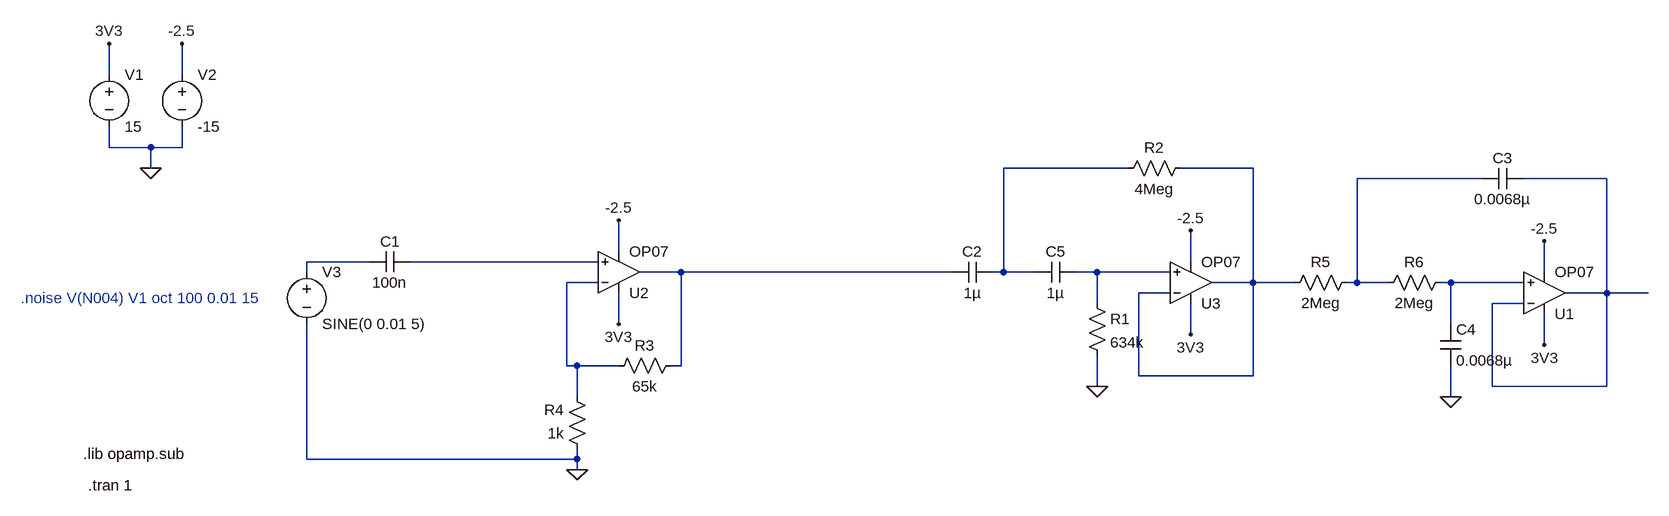
[diagram p0: schematic TI-artikel.asc]
TI-artikel.asc, the LTspice schematic file:
Version 4
SHEET 1 2392 680
WIRE -464 -144 -464 -192
WIRE -352 -144 -352 -192
WIRE -464 -32 -464 -64
WIRE -400 -32 -464 -32
WIRE -352 -32 -352 -64
WIRE -352 -32 -400 -32
WIRE -400 0 -400 -32
WIRE 1104 0 912 0
WIRE 1296 0 1184 0
WIRE 1648 16 1456 16
WIRE 1840 16 1712 16
WIRE 320 128 320 80
WIRE -64 144 -160 144
WIRE 288 144 0 144
WIRE 1200 144 1200 96
WIRE -160 160 -160 144
WIRE 416 160 352 160
WIRE 832 160 416 160
WIRE 912 160 912 0
WIRE 912 160 896 160
WIRE 960 160 912 160
WIRE 1056 160 1024 160
WIRE 1168 160 1056 160
WIRE 1744 160 1744 112
WIRE 288 176 240 176
WIRE 1296 176 1296 0
WIRE 1296 176 1232 176
WIRE 1360 176 1296 176
WIRE 1456 176 1456 16
WIRE 1456 176 1440 176
WIRE 1504 176 1456 176
WIRE 1600 176 1584 176
WIRE 1712 176 1600 176
WIRE 1168 192 1120 192
WIRE 1840 192 1840 16
WIRE 1840 192 1776 192
WIRE 1904 192 1840 192
WIRE 1056 208 1056 160
WIRE 1712 208 1664 208
WIRE 320 240 320 192
WIRE 1600 240 1600 176
WIRE 1200 256 1200 208
WIRE 1744 272 1744 224
WIRE 240 304 240 176
WIRE 256 304 240 304
WIRE 320 304 256 304
WIRE 416 304 416 160
WIRE 416 304 400 304
WIRE 1120 320 1120 192
WIRE 1296 320 1296 176
WIRE 1296 320 1120 320
WIRE 1056 336 1056 288
WIRE 1664 336 1664 208
WIRE 1840 336 1840 192
WIRE 1840 336 1664 336
WIRE 256 352 256 304
WIRE 1600 352 1600 304
WIRE -160 448 -160 240
WIRE 256 448 256 432
WIRE 256 448 -160 448
WIRE 256 464 256 448
FLAG -400 0 0
FLAG -464 -192 3V3
FLAG -352 -192 -2.5
FLAG 320 240 3V3
FLAG 320 80 -2.5
FLAG 256 464 0
FLAG 1600 352 0
FLAG 1744 272 3V3
FLAG 1744 112 -2.5
FLAG 1056 336 0
FLAG 1200 256 3V3
FLAG 1200 96 -2.5
SYMBOL res 416 288 R90
WINDOW 0 0 56 VBottom 2
WINDOW 3 32 56 VTop 2
SYMATTR InstName R3
SYMATTR Value 65k
SYMBOL res 272 448 R180
WINDOW 0 36 76 Left 2
WINDOW 3 36 40 Left 2
SYMATTR InstName R4
SYMATTR Value 1k
SYMBOL OpAmps\\OP07 320 224 M180
SYMATTR InstName U2
SYMBOL voltage -464 -160 R0
WINDOW 123 0 0 Left 0
WINDOW 39 0 0 Left 0
SYMATTR InstName V1
SYMATTR Value 15
SYMBOL voltage -352 -160 R0
WINDOW 123 0 0 Left 0
WINDOW 39 0 0 Left 0
SYMATTR InstName V2
SYMATTR Value -15
SYMBOL voltage -160 144 R0
WINDOW 123 0 0 Left 0
WINDOW 39 0 0 Left 0
SYMATTR InstName V3
SYMATTR Value SINE(0 0.01 5)
SYMBOL res 1456 160 R90
WINDOW 0 0 56 VBottom 2
WINDOW 3 32 56 VTop 2
SYMATTR InstName R5
SYMATTR Value 2Meg
SYMBOL res 1600 160 R90
WINDOW 0 0 56 VBottom 2
WINDOW 3 32 56 VTop 2
SYMATTR InstName R6
SYMATTR Value 2Meg
SYMBOL cap 1712 0 R90
WINDOW 0 0 32 VBottom 2
WINDOW 3 32 32 VTop 2
SYMATTR InstName C3
SYMATTR Value 0.0068µ
SYMATTR SpiceLine V=16 Irms=0 Rser=0.0272 Lser=346p mfg="Würth Elektronik" pn="885012008016 WCAP-CSGP 1206" type="NP0"
SYMBOL cap 1584 240 R0
SYMATTR InstName C4
SYMATTR Value 0.0068µ
SYMATTR SpiceLine V=16 Irms=0 Rser=0.0272 Lser=346p mfg="Würth Elektronik" pn="885012008016 WCAP-CSGP 1206" type="NP0"
SYMBOL OpAmps\\OP07 1744 256 M180
SYMATTR InstName U1
SYMBOL cap 0 128 R90
WINDOW 0 0 32 VBottom 2
WINDOW 3 32 32 VTop 2
SYMATTR InstName C1
SYMATTR Value 100n
SYMBOL OpAmps\\OP07 1200 240 M180
SYMATTR InstName U3
SYMBOL cap 896 144 R90
WINDOW 0 0 32 VBottom 2
WINDOW 3 32 32 VTop 2
SYMATTR InstName C2
SYMATTR Value 1µ
SYMATTR SpiceLine V=6.3 Irms=0 Rser=0.0078 Lser=439p mfg="Würth Elektronik" pn="885012206002 WCAP-CSGP 0603" type="X7R"
SYMBOL cap 1024 144 R90
WINDOW 0 0 32 VBottom 2
WINDOW 3 32 32 VTop 2
SYMATTR InstName C5
SYMATTR Value 1µ
SYMATTR SpiceLine V=6.3 Irms=0 Rser=0.0078 Lser=439p mfg="Würth Elektronik" pn="885012206002 WCAP-CSGP 0603" type="X7R"
SYMBOL res 1040 192 R0
SYMATTR InstName R1
SYMATTR Value 634k
SYMBOL res 1200 -16 R90
WINDOW 0 0 56 VBottom 2
WINDOW 3 32 56 VTop 2
SYMATTR InstName R2
SYMATTR Value 4Meg
TEXT -496 488 Left 2 !.tran 1
TEXT -504 440 Left 2 !.lib opamp.sub
TEXT -600 200 Left 2 ;.noise V(N004) V1 oct 100 0.01 15

The netlist it stands for:
* TI-artikel.asc
R3 N007 N009 65k
R4 0 N009 1k
XU2 N006 N009 3V3 -2.5 N007 LT1001  ; OP07, pins In+ In- V+ V- OUT
V1 3V3 0 15
V2 -2.5 0 -15
V3 N005 0 SINE(0 0.01 5)
R5 N003 N002 2Meg
R6 N010 N003 2Meg
C3 N004 N003 0.0068µ V=16 Irms=0 Rser=0.0272 Lser=346p mfg="Würth Elektronik" pn="885012008016 WCAP-CSGP 1206" type="NP0"
C4 N010 0 0.0068µ V=16 Irms=0 Rser=0.0272 Lser=346p mfg="Würth Elektronik" pn="885012008016 WCAP-CSGP 1206" type="NP0"
XU1 N010 N004 3V3 -2.5 N004 LT1001  ; OP07, pins In+ In- V+ V- OUT
C1 N006 N005 100n
XU3 N008 N002 3V3 -2.5 N002 LT1001  ; OP07, pins In+ In- V+ V- OUT
C2 N001 N007 1µ V=6.3 Irms=0 Rser=0.0078 Lser=439p mfg="Würth Elektronik" pn="885012206002 WCAP-CSGP 0603" type="X7R"
C5 N008 N001 1µ V=6.3 Irms=0 Rser=0.0078 Lser=439p mfg="Würth Elektronik" pn="885012206002 WCAP-CSGP 0603" type="X7R"
R1 N008 0 634k
R2 N002 N001 4Meg
.tran 1
.lib opamp.sub
* .noise V(N004) V1 oct 100 0.01 15
.lib LTC.lib
.backanno
.end